# Altium schematic sheet Sheet2.SchDoc
size A4; SheetNumber: 1; SheetTotal: 1
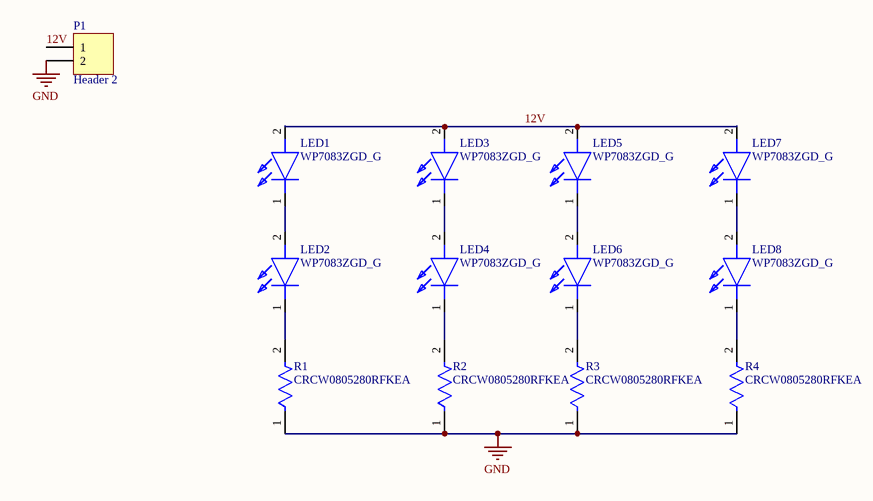
[diagram p0: Sheet2.SchDoc]

## Parts
LED1  WP7083ZGD_G  [L53ND]
LED2  WP7083ZGD_G  [L53ND]
LED3  WP7083ZGD_G  [L53ND]
LED4  WP7083ZGD_G  [L53ND]
LED5  WP7083ZGD_G  [L53ND]
LED6  WP7083ZGD_G  [L53ND]
LED7  WP7083ZGD_G  [L53ND]
LED8  WP7083ZGD_G  [L53ND]
P1  Header 2  [HDR1X2]
R1  CRCW0805280RFKEA  [FP-CRCW0805-e3-MFG]
R2  CRCW0805280RFKEA  [FP-CRCW0805-e3-MFG]
R3  CRCW0805280RFKEA  [FP-CRCW0805-e3-MFG]
R4  CRCW0805280RFKEA  [FP-CRCW0805-e3-MFG]

## Nets
GND: P1.2 R1.1 R2.1 R3.1 R4.1
12V: LED1.2(A) LED3.2(A) LED5.2(A) LED7.2(A) P1.1
NetLED1_1: LED1.1(K) LED2.2(A)
NetLED2_1: LED2.1(K) R1.2
NetLED3_1: LED3.1(K) LED4.2(A)
NetLED4_1: LED4.1(K) R2.2
NetLED5_1: LED5.1(K) LED6.2(A)
NetLED6_1: LED6.1(K) R3.2
NetLED7_1: LED7.1(K) LED8.2(A)
NetLED8_1: LED8.1(K) R4.2

## Library data of the parts
LED1-LED8 = WP7083ZGD_G: LED; Manufacturer_Name: Kingbright; Manufacturer_Part_Number: WP7083ZGD/G; Datasheet Link: http://www.kingbrightusa.com/images/catalog/SPEC/WP7083ZGD-G.pdf; Height: 8.85mm; Mouser Part Number: 604-WP7083ZGD/G; Mouser Price/Stock: https://www.mouser.co.uk/ProductDetail/Kingbright/WP7083ZGD-G?qs=vEWui5pQpauzaZd%252BFRBkgQ%3D%3D
P1 = Header 2: Header, 2-Pin; LatestRevisionDate: 17-Jul-2002; LatestRevisionNote: Re-released for DXP Platform.; Publisher: Altium Limited
R1-R4 = CMP-2001-03748-2: RES Thick Film, 280Ω, 1%, 0.125W, 100ppm/°C, 0805; Power Rating: 125mW; Resistance: 280R; Voltage Rating (DC): 150V; Composition: Thick Film; Radiation Hardening: No; Width: 1.25mm; Lead Free: Lead Free; Depth: 1.25mm; Case Code (Imperial): 0805; Packaging: Tape and Reel; Weight: 0.000194oz; Number of Terminations: 2; Military Standard: Not; Contact Plating: Tin; Package Quantity: 10; Voltage Rating: 150V; Tolerance: 1%; Max Operating Temperature: 155°C; Case Code (Metric): 2012; Max Power Dissipation: 125mW; Temperature Coefficient: 100ppm/°C; Case/Package: 0805; Length: 2mm; Termination: SMD/SMT; Min Operating Temperature: -55°C; Height: 0.02inch; Features: Automotive AEC-Q200